# EAGLE design control_unit_new (EAGLE 5.11)

## Sheet 1 of 4
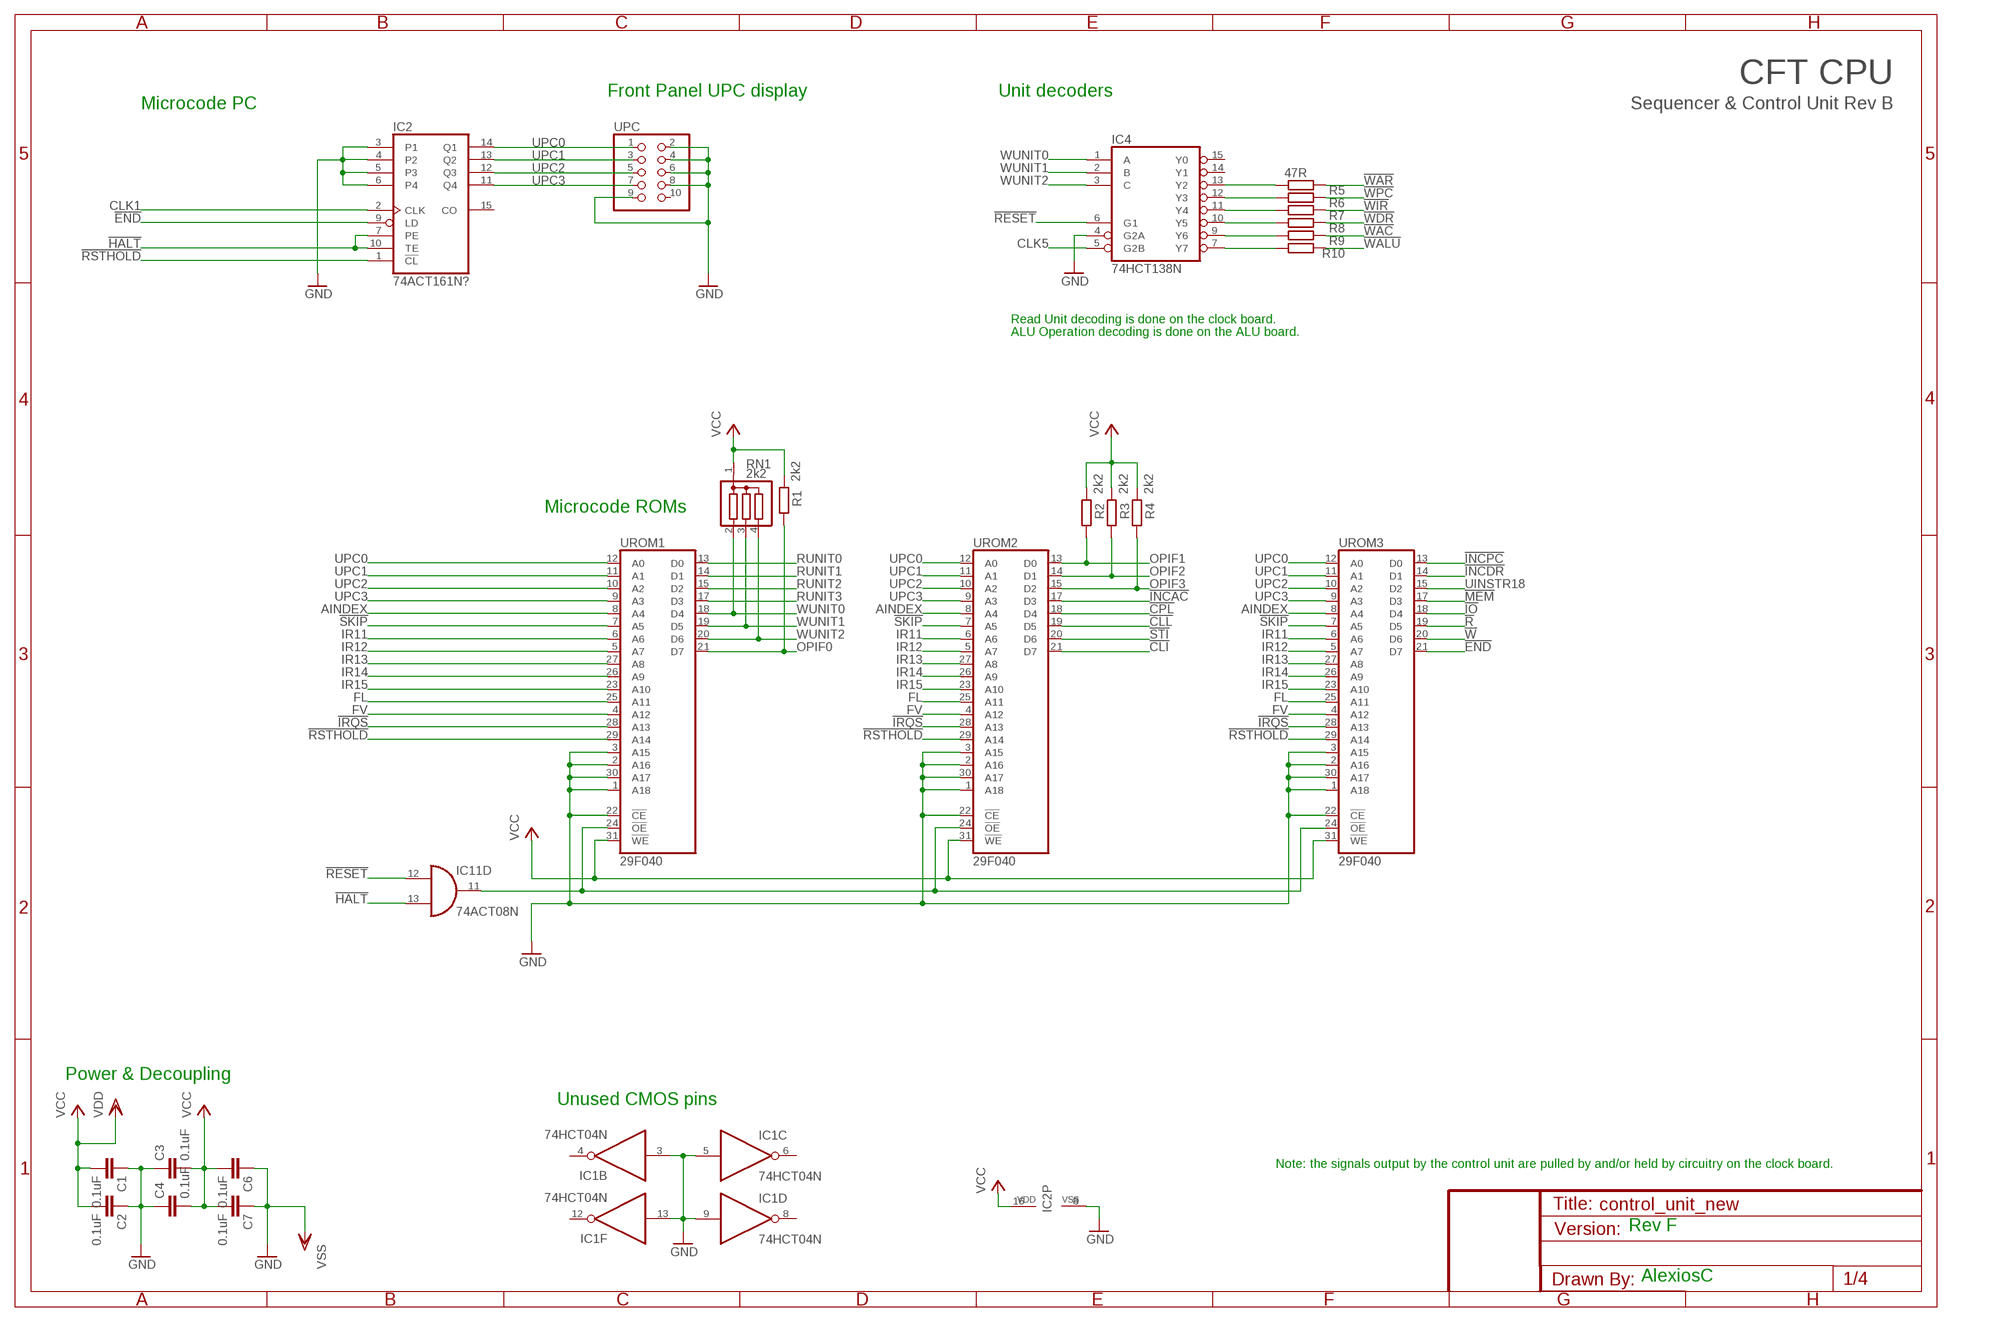
[diagram p0: schematic, sheet 1]

### Parts
C1  0.1uF  C-EU025-025X050  [C025-025X050]
C2  0.1uF  C-EU025-025X050  [C025-025X050]
C3  0.1uF  C-EU025-025X050  [C025-025X050]
C4  0.1uF  C-EU025-025X050  [C025-025X050]
C6  0.1uF  C-EU025-025X050  [C025-025X050]
C7  0.1uF  C-EU025-025X050  [C025-025X050]
IC1  74HCT04N  [DIL14]
IC2  74ACT161N?  4161P  [DIL16]
IC4  74HCT138N  [DIL16]
IC11  74ACT08N  [DIL14]
R1  2k2  R-EU_0207/7  [0207/7]
R2  2k2  R-EU_0207/7  [0207/7]
R3  2k2  R-EU_0207/7  [0207/7]
R4  2k2  R-EU_0207/7  [0207/7]
R5  47R  R-EU_0207/2V  [0207/2V]
R6  47R  R-EU_0207/2V  [0207/2V]
R7  47R  R-EU_0207/2V  [0207/2V]
R8  47R  R-EU_0207/2V  [0207/2V]
R9  47R  R-EU_0207/2V  [0207/2V]
R10  47R  R-EU_0207/2V  [0207/2V]
RN1  2k2  G03R  [SIL4]
UPC  PINHD-2X5/90  [2X05/90]
UROM1  29F040  29F040DIP32  [DIL32]
UROM2  29F040  29F040DIP32  [DIL32]
UROM3  29F040  29F040DIP32  [DIL32]

### Nets
!CLI: UROM2.21(D7)
!CLL: UROM2.19(D5)
!CPL: UROM2.18(D4)
!END: IC2.9(LD) UROM3.21(D7)
!HALT: IC2.7(PE) IC2.10(TE) IC11.13(D:I1) ; also sheet 3
!INCAC: UROM2.17(D3)
!INCDR: UROM3.14(D1)
!INCPC: UROM3.13(D0) ; also sheet 3
!IO: UROM3.18(D4) ; also sheet 3
!IRQS: UROM1.28(A13) UROM2.28(A13) UROM3.28(A13)
!MEM: UROM3.17(D3) ; also sheet 3
!R: UROM3.19(D5) ; also sheet 3
!RESET: IC4.6(G1) IC11.12(D:I0) ; also sheet 2,3
!RSTHOLD: IC2.1(!CL) UROM1.29(A14) UROM2.29(A14) UROM3.29(A14) ; also sheet 2,3
!SKIP: UROM1.7(A5) UROM2.7(A5) UROM3.7(A5) ; also sheet 2
!STI: UROM2.20(D6)
!W: UROM3.20(D6) ; also sheet 3
!WAC: R9.2 ; also sheet 3
!WALU: R10.2 ; also sheet 3
!WAR: R5.2 ; also sheet 3
!WDR: R8.2 ; also sheet 3
!WIR: R7.2 ; also sheet 2,3
!WPC: R6.2 ; also sheet 3
AINDEX: UROM1.8(A4) UROM2.8(A4) UROM3.8(A4)
CLK1: IC2.2(CLK) ; also sheet 2,3
CLK5: IC4.5(G2B) ; also sheet 3
FL: UROM1.25(A11) UROM2.25(A11) UROM3.25(A11) ; also sheet 2
FV: UROM1.4(A12) UROM2.4(A12) UROM3.4(A12) ; also sheet 2
GND [Power]: C1.1 C2.1 C3.1 C4.1 C6.1 C7.1 IC1.3(B:I) IC1.5(C:I) IC1.9(D:I) IC1.13(F:I) IC2.3(P1) IC2.4(P2) IC2.5(P3) IC2.6(P4) IC2.8(VSS) IC4.4(G2A) UPC.2 UPC.4 UPC.6 UPC.8 UPC.9 UROM1.1(A18) UROM1.2(A16) UROM1.3(A15) UROM1.22(!CE) UROM1.30(A17) UROM2.1(A18) UROM2.2(A16) UROM2.3(A15) UROM2.22(!CE) UROM2.30(A17) UROM3.1(A18) UROM3.2(A16) UROM3.3(A15) UROM3.22(!CE) UROM3.30(A17) ; supply symbol labelled VSS ; also sheet 2,3,4
IR11: UROM1.6(A6) UROM2.6(A6) UROM3.6(A6) ; also sheet 2
IR12: UROM1.5(A7) UROM2.5(A7) UROM3.5(A7) ; also sheet 2
IR13: UROM1.27(A8) UROM2.27(A8) UROM3.27(A8) ; also sheet 2
IR14: UROM1.26(A9) UROM2.26(A9) UROM3.26(A9) ; also sheet 2
IR15: UROM1.23(A10) UROM2.23(A10) UROM3.23(A10) ; also sheet 2
N$1: IC11.11(D:O) UROM1.24(!OE) UROM2.24(!OE) UROM3.24(!OE)
N$7: IC4.13(Y2) R5.1
N$8: IC4.12(Y3) R6.1
N$9: IC4.11(Y4) R7.1
N$10: IC4.10(Y5) R8.1
N$11: IC4.9(Y6) R9.1
N$12: IC4.7(Y7) R10.1
OPIF0: R1.1 UROM1.21(D7) ; also sheet 2
OPIF1: R2.1 UROM2.13(D0) ; also sheet 2
OPIF2: R3.1 UROM2.14(D1) ; also sheet 2
OPIF3: R4.1 UROM2.15(D2) ; also sheet 2
RUNIT0: UROM1.13(D0)
RUNIT1: UROM1.14(D1)
RUNIT2: UROM1.15(D2)
RUNIT3: UROM1.17(D3)
UINSTR18: UROM3.15(D2)
UPC0: IC2.14(Q1) UPC.1 UROM1.12(A0) UROM2.12(A0) UROM3.12(A0)
UPC1: IC2.13(Q2) UPC.3 UROM1.11(A1) UROM2.11(A1) UROM3.11(A1)
UPC2: IC2.12(Q3) UPC.5 UROM1.10(A2) UROM2.10(A2) UROM3.10(A2)
UPC3: IC2.11(Q4) UPC.7 UROM1.9(A3) UROM2.9(A3) UROM3.9(A3)
VCC [Power]: C1.2 C2.2 C3.2 C4.2 C6.2 C7.2 IC2.16(VDD) R1.2 R2.2 R3.2 R4.2 RN1.1 UROM1.31(!WE) UROM2.31(!WE) UROM3.31(!WE) ; supply symbol labelled VDD ; also sheet 2,3,4
WUNIT0: IC4.1(A) RN1.2 UROM1.18(D4)
WUNIT1: IC4.2(B) RN1.3 UROM1.19(D5)
WUNIT2: IC4.3(C) RN1.4 UROM1.20(D6)
Unconnected: IC1.1(A:I) IC1.2(A:O) IC1.4(B:O) IC1.6(C:O) IC1.8(D:O) IC1.12(F:O) IC2.15(CO) IC4.14(Y1) IC4.15(Y0) UPC.10

### Notes on the sheet
- CFT CPU
- Front Panel UPC display | Unit decoders
- Microcode PC | Sequencer & Control Unit Rev B
- Read Unit decoding is done on the clock board.
- ALU Operation decoding is done on the ALU board.
- Microcode ROMs
- Power & Decoupling
- Unused CMOS pins
- Note: the signals output by the control unit are pulled by and/or held by circuitry on the clock board.
- Rev F
- AlexiosC

## Sheet 2 of 4
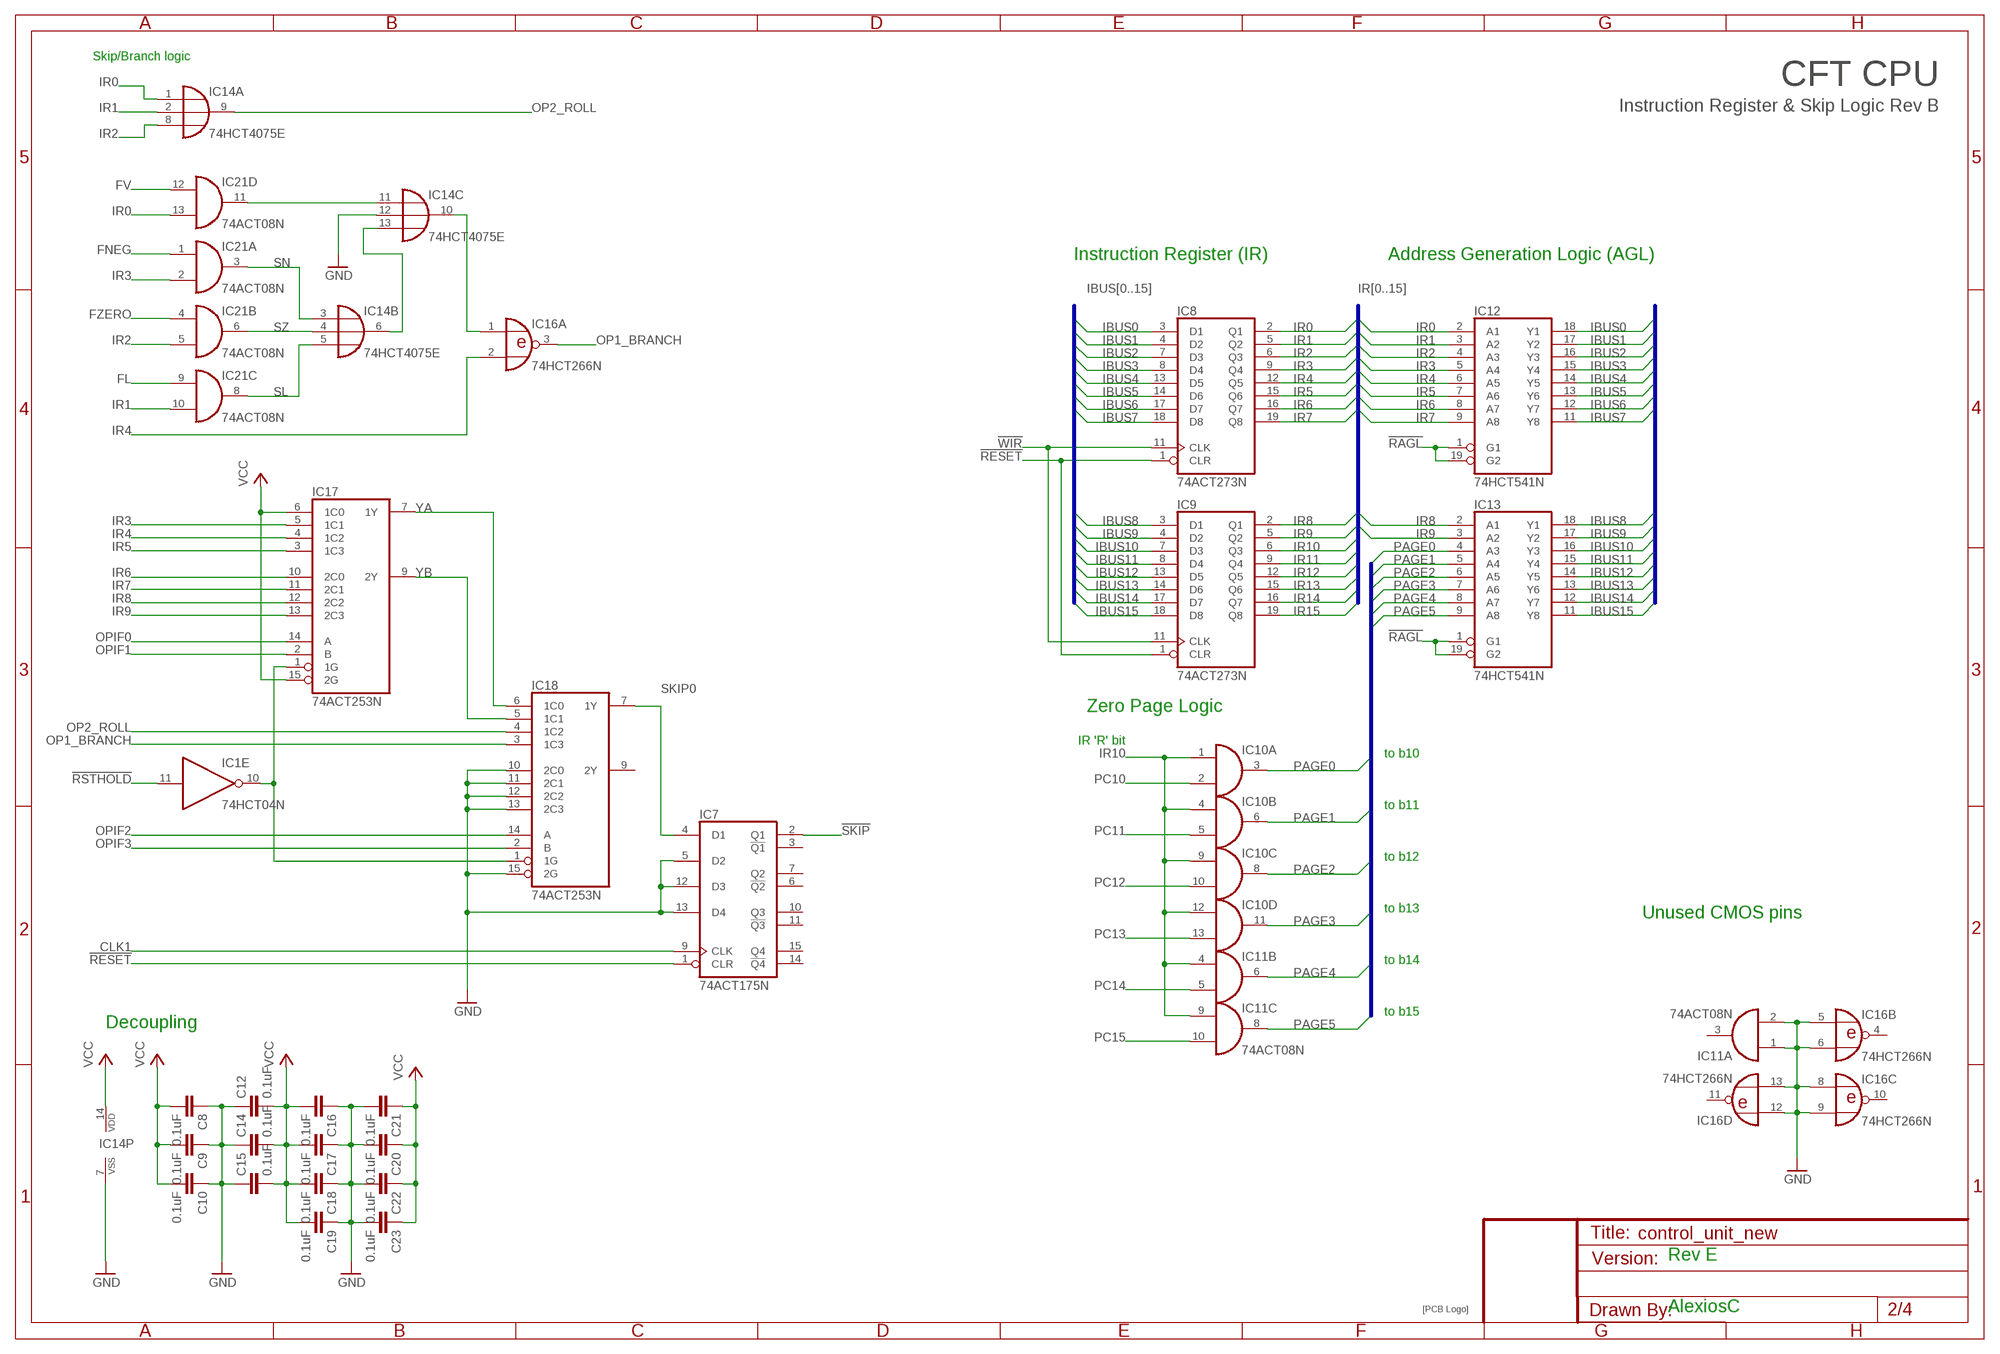
[diagram p1: schematic, sheet 2]

### Parts
C8  0.1uF  C-EU025-025X050  [C025-025X050]
C9  0.1uF  C-EU025-025X050  [C025-025X050]
C10  0.1uF  C-EU025-025X050  [C025-025X050]
C12  0.1uF  C-EU025-025X050  [C025-025X050]
C14  0.1uF  C-EU025-025X050  [C025-025X050]
C15  0.1uF  C-EU025-025X050  [C025-025X050]
C16  0.1uF  C-EU025-025X050  [C025-025X050]
C17  0.1uF  C-EU025-025X050  [C025-025X050]
C18  0.1uF  C-EU025-025X050  [C025-025X050]
C19  0.1uF  C-EU025-025X050  [C025-025X050]
C20  0.1uF  C-EU025-025X050  [C025-025X050]
C21  0.1uF  C-EU025-025X050  [C025-025X050]
C22  0.1uF  C-EU025-025X050  [C025-025X050]
C23  0.1uF  C-EU025-025X050  [C025-025X050]
IC7  74ACT175N  [DIL16]
IC8  74ACT273N  [DIL20]
IC9  74ACT273N  [DIL20]
IC10  74ACT08N  [DIL14]
IC12  74HCT541N  [DIL20]
IC13  74HCT541N  [DIL20]
IC14  74HCT4075E  4075N  [DIL14]
IC16  74HCT266N  74HC266N  [DIL14]
IC17  74ACT253N  [DIL16]
IC18  74ACT253N  [DIL16]
IC21  74ACT08N  [DIL14]
U$3  SIGNATURESILK  [SIGNATURE]

### Nets
!RAGL: IC12.1(G1) IC12.19(G2) IC13.1(G1) IC13.19(G2) ; also sheet 3
!RESET: IC7.1(CLR) IC8.1(CLR) IC9.1(CLR) ; also sheet 1,3
!RSTHOLD: IC1.11(E:I) ; also sheet 1,3
!SKIP: IC7.2(Q1) ; also sheet 1
!WIR: IC8.11(CLK) IC9.11(CLK) ; also sheet 1,3
CLK1: IC7.9(CLK) ; also sheet 1,3
FL: IC21.9(C:I0) ; also sheet 1
FNEG: IC21.1(A:I0)
FV: IC21.12(D:I0) ; also sheet 1
FZERO: IC21.4(B:I0)
GND [Power]: C8.1 C9.1 C10.1 C12.1 C14.1 C15.1 C16.1 C17.1 C18.1 C19.1 C20.2 C21.2 C22.2 C23.2 IC7.5(D2) IC7.12(D3) IC7.13(D4) IC11.1(A:I0) IC11.2(A:I1) IC14.7(P:VSS) IC14.12(C:I1) IC16.5(B:I0) IC16.6(B:I1) IC16.8(C:I0) IC16.9(C:I1) IC16.12(D:I0) IC16.13(D:I1) IC18.10(2C0) IC18.11(2C1) IC18.12(2C2) IC18.13(2C3) IC18.15(2G) ; also sheet 1,3,4
IBUS0: IC8.3(D1) IC12.18(Y1) ; also sheet 3
IBUS1: IC8.4(D2) IC12.17(Y2) ; also sheet 3
IBUS2: IC8.7(D3) IC12.16(Y3) ; also sheet 3
IBUS3: IC8.8(D4) IC12.15(Y4) ; also sheet 3
IBUS4: IC8.13(D5) IC12.14(Y5) ; also sheet 3
IBUS5: IC8.14(D6) IC12.13(Y6) ; also sheet 3
IBUS6: IC8.17(D7) IC12.12(Y7) ; also sheet 3
IBUS7: IC8.18(D8) IC12.11(Y8) ; also sheet 3
IBUS8: IC9.3(D1) IC13.18(Y1) ; also sheet 3
IBUS9: IC9.4(D2) IC13.17(Y2) ; also sheet 3
IBUS10: IC9.7(D3) IC13.16(Y3) ; also sheet 3
IBUS11: IC9.8(D4) IC13.15(Y4) ; also sheet 3
IBUS12: IC9.13(D5) IC13.14(Y5) ; also sheet 3
IBUS13: IC9.14(D6) IC13.13(Y6) ; also sheet 3
IBUS14: IC9.17(D7) IC13.12(Y7) ; also sheet 3
IBUS15: IC9.18(D8) IC13.11(Y8) ; also sheet 3
IR0: IC8.2(Q1) IC12.2(A1) IC14.1(A:I0) IC21.13(D:I1)
IR1: IC8.5(Q2) IC12.3(A2) IC14.2(A:I1) IC21.10(C:I1)
IR2: IC8.6(Q3) IC12.4(A3) IC14.8(A:I2) IC21.5(B:I1)
IR3: IC8.9(Q4) IC12.5(A4) IC17.5(1C1) IC21.2(A:I1)
IR4: IC8.12(Q5) IC12.6(A5) IC16.2(A:I1) IC17.4(1C2)
IR5: IC8.15(Q6) IC12.7(A6) IC17.3(1C3)
IR6: IC8.16(Q7) IC12.8(A7) IC17.10(2C0)
IR7: IC8.19(Q8) IC12.9(A8) IC17.11(2C1)
IR8: IC9.2(Q1) IC13.2(A1) IC17.12(2C2)
IR9: IC9.5(Q2) IC13.3(A2) IC17.13(2C3)
IR10: IC9.6(Q3) IC10.1(A:I0) IC10.4(B:I0) IC10.9(C:I0) IC10.12(D:I0) IC11.4(B:I0) IC11.9(C:I0)
IR11: IC9.9(Q4) ; also sheet 1
IR12: IC9.12(Q5) ; also sheet 1
IR13: IC9.15(Q6) ; also sheet 1
IR14: IC9.16(Q7) ; also sheet 1
IR15: IC9.19(Q8) ; also sheet 1
N$2: IC14.10(C:O) IC16.1(A:I0)
N$13: IC14.6(B:O) IC14.13(C:I2)
N$14: IC14.11(C:I0) IC21.11(D:O)
OP1_BRANCH: IC16.3(A:O) IC18.3(1C3)
OP2_ROLL: IC14.9(A:O) IC18.4(1C2)
OPIF0: IC17.14(A) ; also sheet 1
OPIF1: IC17.2(B) ; also sheet 1
OPIF2: IC18.14(A) ; also sheet 1
OPIF3: IC18.2(B) ; also sheet 1
PAGE0: IC10.3(A:O) IC13.4(A3)
PAGE1: IC10.6(B:O) IC13.5(A4)
PAGE2: IC10.8(C:O) IC13.6(A5)
PAGE3: IC10.11(D:O) IC13.7(A6)
PAGE4: IC11.6(B:O) IC13.8(A7)
PAGE5: IC11.8(C:O) IC13.9(A8)
PC10: IC10.2(A:I1)
PC11: IC10.5(B:I1)
PC12: IC10.10(C:I1)
PC13: IC10.13(D:I1)
PC14: IC11.5(B:I1)
PC15: IC11.10(C:I1)
RSTHOLD: IC1.10(E:O) IC17.1(1G) IC18.1(1G)
SKIP0: IC7.4(D1) IC18.7(1Y)
SL: IC14.5(B:I2) IC21.8(C:O)
SN: IC14.3(B:I0) IC21.3(A:O)
SZ: IC14.4(B:I1) IC21.6(B:O)
VCC [Power]: C8.2 C9.2 C10.2 C12.2 C14.2 C15.2 C16.2 C17.2 C18.2 C19.2 C20.1 C21.1 C22.1 C23.1 IC14.14(P:VDD) IC17.6(1C0) IC17.15(2G) ; also sheet 1,3,4
YA: IC17.7(1Y) IC18.6(1C0)
YB: IC17.9(2Y) IC18.5(1C1)
Unconnected: IC7.3(!Q1) IC7.6(!Q2) IC7.7(Q2) IC7.10(Q3) IC7.11(!Q3) IC7.14(!Q4) IC7.15(Q4) IC11.3(A:O) IC16.4(B:O) IC16.10(C:O) IC16.11(D:O) IC18.9(2Y)

### Buses
IBUS[0..15]
IR[0..15]
PAGE[0..5]

### Notes on the sheet
- Skip/Branch logic
- CFT CPU
- Instruction Register & Skip Logic Rev B
- Instruction Register (IR) | Address Generation Logic (AGL)
- Zero Page Logic
- IR 'R' bit
- to b10
- to b11
- to b12
- to b13
- Unused CMOS pins
- to b14
- to b15
- Decoupling
- Rev E
- AlexiosC

## Sheet 3 of 4
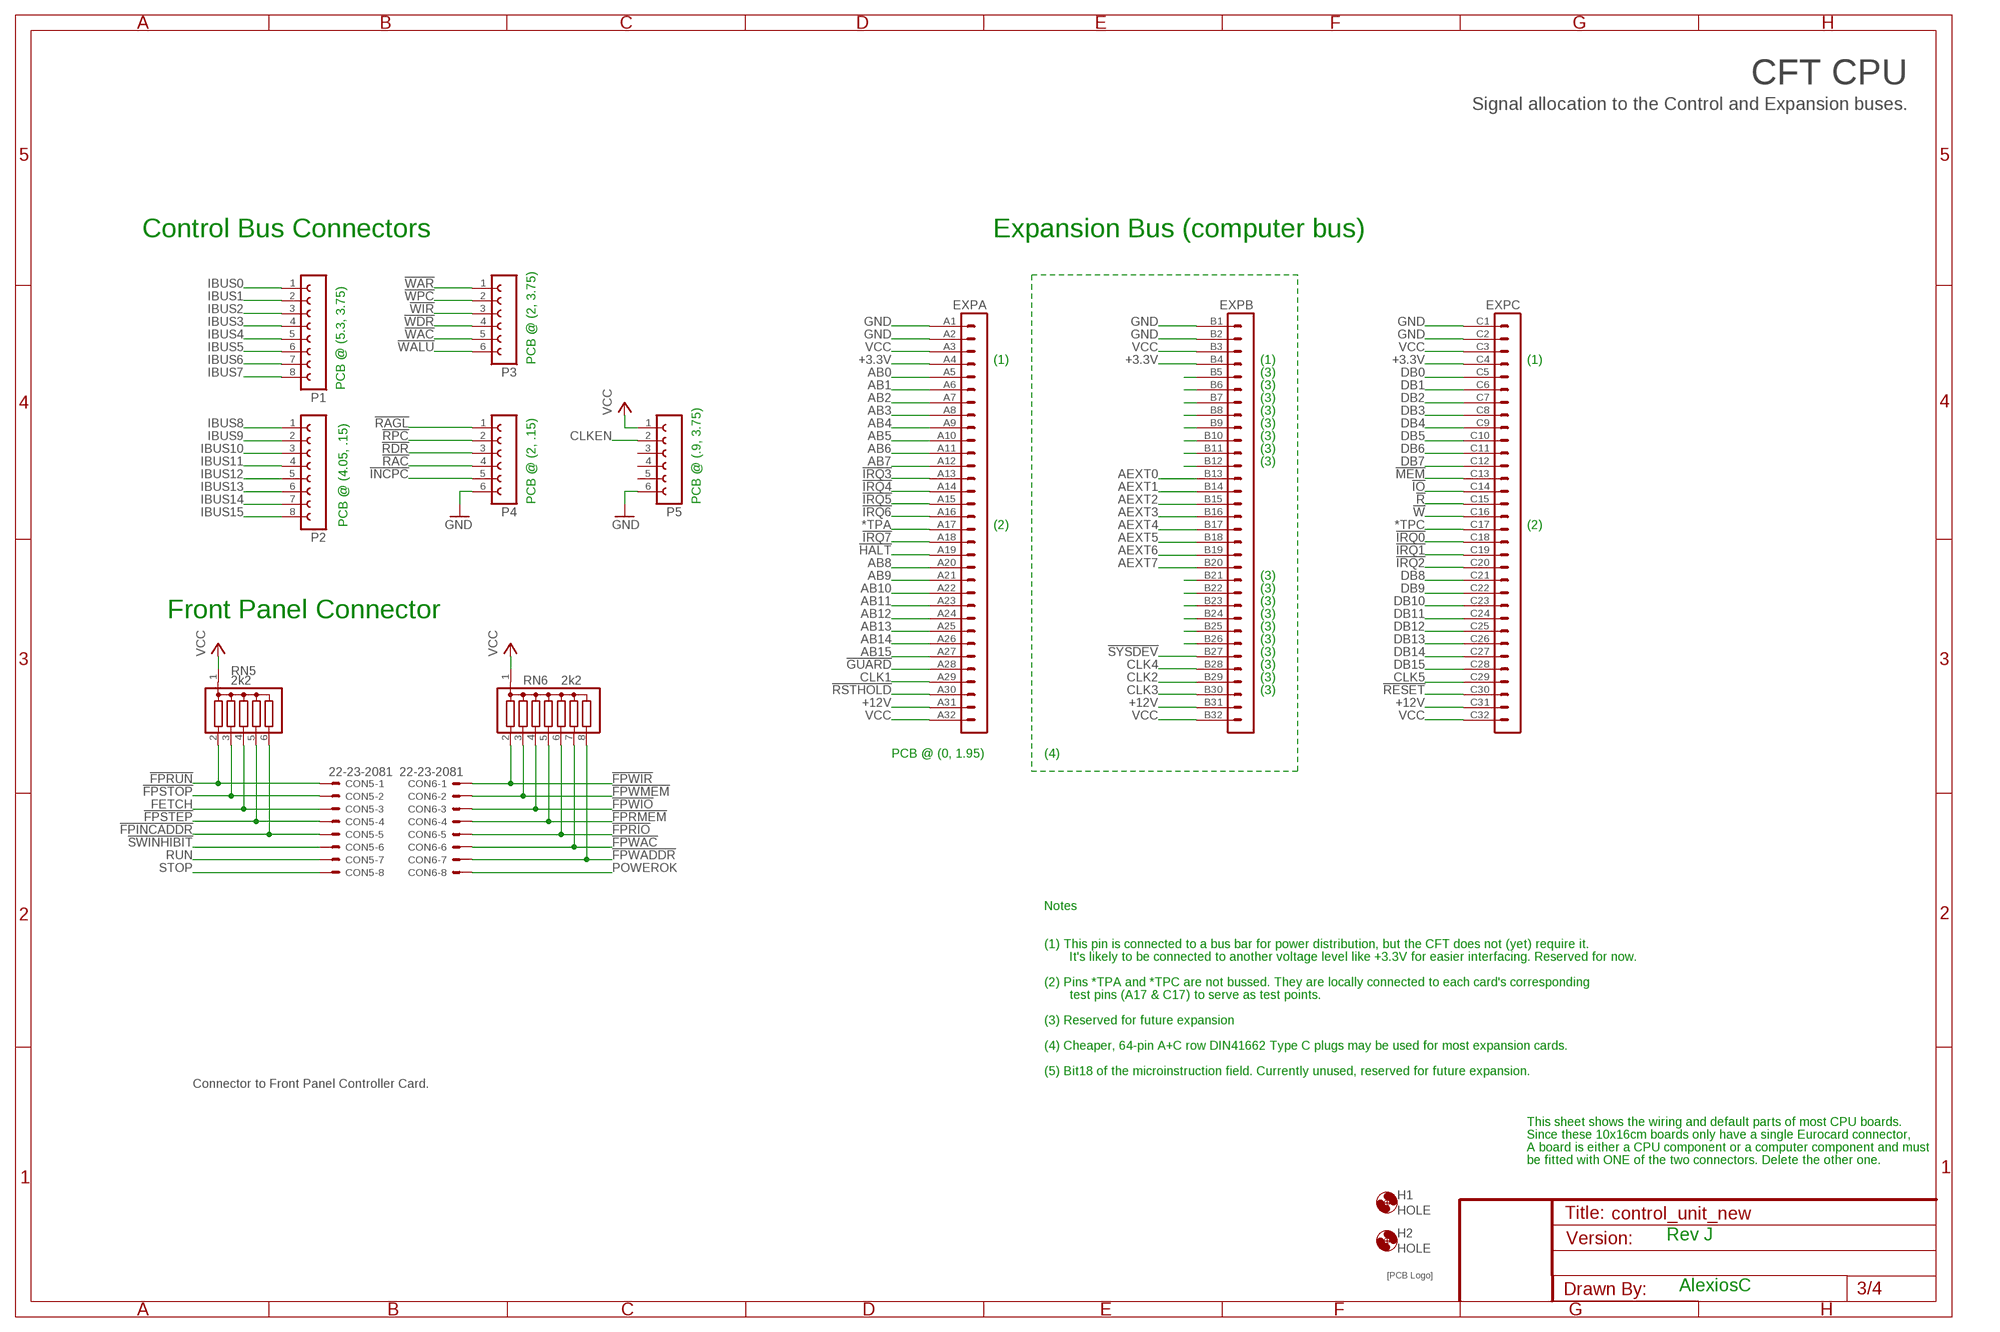
[diagram p2: schematic, sheet 3]

### Parts
CON5  22-23-2081  [22-23-2081]
CON6  22-23-2081  [22-23-2081]
EXP  VG96-3B  [VG96B]
H1  HOLE  [STANDOFF_28_60]
H2  HOLE  [STANDOFF_28_60]
P1  FE08-1  [FE08]
P2  FE08-1  [FE08]
P3  FE06-1  [FE06]
P4  FE06-1  [FE06]
P5  FE06-1  [FE06]
RN5  2k2  G05R  [SIL6]
RN6  2k2  G07R  [SIL8]
U$1  SIGNATURESILK  [SIGNATURE]

### Nets
!FPINCADDR: CON5.5 RN5.6
!FPRIO: CON6.5 RN6.6
!FPRMEM: CON6.4 RN6.5
!FPRUN: CON5.1 RN5.2
!FPSTEP: CON5.4 RN5.5
!FPSTOP: CON5.2 RN5.3
!FPWAC: CON6.6 RN6.7
!FPWADDR: CON6.7 RN6.8
!FPWIO: CON6.3 RN6.4
!FPWIR: CON6.1 RN6.2
!FPWMEM: CON6.2 RN6.3
!GUARD: EXP.A28
!HALT: EXP.A19 ; also sheet 1
!INCPC: P4.5 ; also sheet 1
!IO: EXP.C14 ; also sheet 1
!IRQ0: EXP.C18
!IRQ1: EXP.C19
!IRQ2: EXP.C20
!IRQ3: EXP.A13
!IRQ4: EXP.A14
!IRQ5: EXP.A15
!IRQ6: EXP.A16
!IRQ7: EXP.A18
!MEM: EXP.C13 ; also sheet 1
!R: EXP.C15 ; also sheet 1
!RAC: P4.4
!RAGL: P4.1 ; also sheet 2
!RDR: P4.3
!RESET: EXP.C30 ; also sheet 1,2
!RPC: P4.2
!RSTHOLD: EXP.A30 ; also sheet 1,2
!SWINHIBIT: CON5.6
!SYSDEV: EXP.B27
!W: EXP.C16 ; also sheet 1
!WAC: P3.5 ; also sheet 1
!WALU: P3.6 ; also sheet 1
!WAR: P3.1 ; also sheet 1
!WDR: P3.4 ; also sheet 1
!WIR: P3.3 ; also sheet 1,2
!WPC: P3.2 ; also sheet 1
*TPA: EXP.A17
*TPC: EXP.C17
+3.3V: EXP.A4 EXP.B4 EXP.C4
+12V [12V]: EXP.A31 EXP.B31 EXP.C31
AB0: EXP.A5
AB1: EXP.A6
AB2: EXP.A7
AB3: EXP.A8
AB4: EXP.A9
AB5: EXP.A10
AB6: EXP.A11
AB7: EXP.A12
AB8: EXP.A20
AB9: EXP.A21
AB10: EXP.A22
AB11: EXP.A23
AB12: EXP.A24
AB13: EXP.A25
AB14: EXP.A26
AB15: EXP.A27
AEXT0: EXP.B13
AEXT1: EXP.B14
AEXT2: EXP.B15
AEXT3: EXP.B16
AEXT4: EXP.B17
AEXT5: EXP.B18
AEXT6: EXP.B19
AEXT7: EXP.B20
CLK1: EXP.A29 ; also sheet 1,2
CLK2: EXP.B29
CLK3: EXP.B30
CLK4: EXP.B28
CLK5: EXP.C29 ; also sheet 1
CLKEN: P5.2
DB0: EXP.C5
DB1: EXP.C6
DB2: EXP.C7
DB3: EXP.C8
DB4: EXP.C9
DB5: EXP.C10
DB6: EXP.C11
DB7: EXP.C12
DB8: EXP.C21
DB9: EXP.C22
DB10: EXP.C23
DB11: EXP.C24
DB12: EXP.C25
DB13: EXP.C26
DB14: EXP.C27
DB15: EXP.C28
FETCH: CON5.3 RN5.4
GND [Power]: EXP.A1 EXP.A2 EXP.B1 EXP.B2 EXP.C1 EXP.C2 P4.6 P5.6 ; also sheet 1,2,4
IBUS0: P1.1 ; also sheet 2
IBUS1: P1.2 ; also sheet 2
IBUS2: P1.3 ; also sheet 2
IBUS3: P1.4 ; also sheet 2
IBUS4: P1.5 ; also sheet 2
IBUS5: P1.6 ; also sheet 2
IBUS6: P1.7 ; also sheet 2
IBUS7: P1.8 ; also sheet 2
IBUS8: P2.1 ; also sheet 2
IBUS9: P2.2 ; also sheet 2
IBUS10: P2.3 ; also sheet 2
IBUS11: P2.4 ; also sheet 2
IBUS12: P2.5 ; also sheet 2
IBUS13: P2.6 ; also sheet 2
IBUS14: P2.7 ; also sheet 2
IBUS15: P2.8 ; also sheet 2
N$23: EXP.B12
N$24: EXP.B11
N$25: EXP.B10
N$26: EXP.B9
N$27: EXP.B8
N$28: EXP.B7
N$29: EXP.B6
N$30: EXP.B5
N$33: EXP.B26
N$34: EXP.B25
N$35: EXP.B24
N$36: EXP.B23
N$37: EXP.B22
N$38: EXP.B21
POWEROK: CON6.8
RUN: CON5.7
STOP: CON5.8
VCC [Power]: EXP.A3 EXP.A32 EXP.B3 EXP.B32 EXP.C3 EXP.C32 P5.1 RN5.1 RN6.1 ; also sheet 1,2,4
Unconnected: P5.3 P5.4 P5.5

### Notes on the sheet
- CFT CPU
- Signal allocation to the Control and Expansion buses.
- Control Bus Connectors | Expansion Bus (computer bus)
- PCB @ (2, 3.75) | (1) | (1) | (1)
- (3)
- PCB @ (5.3, 3.75) | (3)
- (3)
- (3)
- (3)
- (3)
- (3)
- (3)
- PCB @ (2, .15) | PCB @ (.9, 3.75)
- PCB @ (4.05, .15) | (2) | (2)
- (3)
- (3)
- (3)
- Front Panel Connector | (3)
- (3)
- (3)
- (3)
- (3)
- (3)
- (3)
- PCB @ (0, 1.95) | (4)
- Notes
- (1) This pin is connected to a bus bar for power distribution, but the CFT does not (yet) require it.
- It's likely to be connected to another voltage level like +3.3V for easier interfacing. Reserved for now.
- (2) Pins *TPA and *TPC are not bussed. They are locally connected to each card's corresponding
- test pins (A17 & C17) to serve as test points.
- (3) Reserved for future expansion
- (4) Cheaper, 64-pin A+C row DIN41662 Type C plugs may be used for most expansion cards.
- (5) Bit18 of the microinstruction field. Currently unused, reserved for future expansion.
- Connector to Front Panel Controller Card.
- This sheet shows the wiring and default parts of most CPU boards.
- Since these 10x16cm boards only have a single Eurocard connector,
- A board is either a CPU component or a computer component and must
- be fitted with ONE of the two connectors. Delete the other one.
- Rev J
- AlexiosC

## Sheet 4 of 4
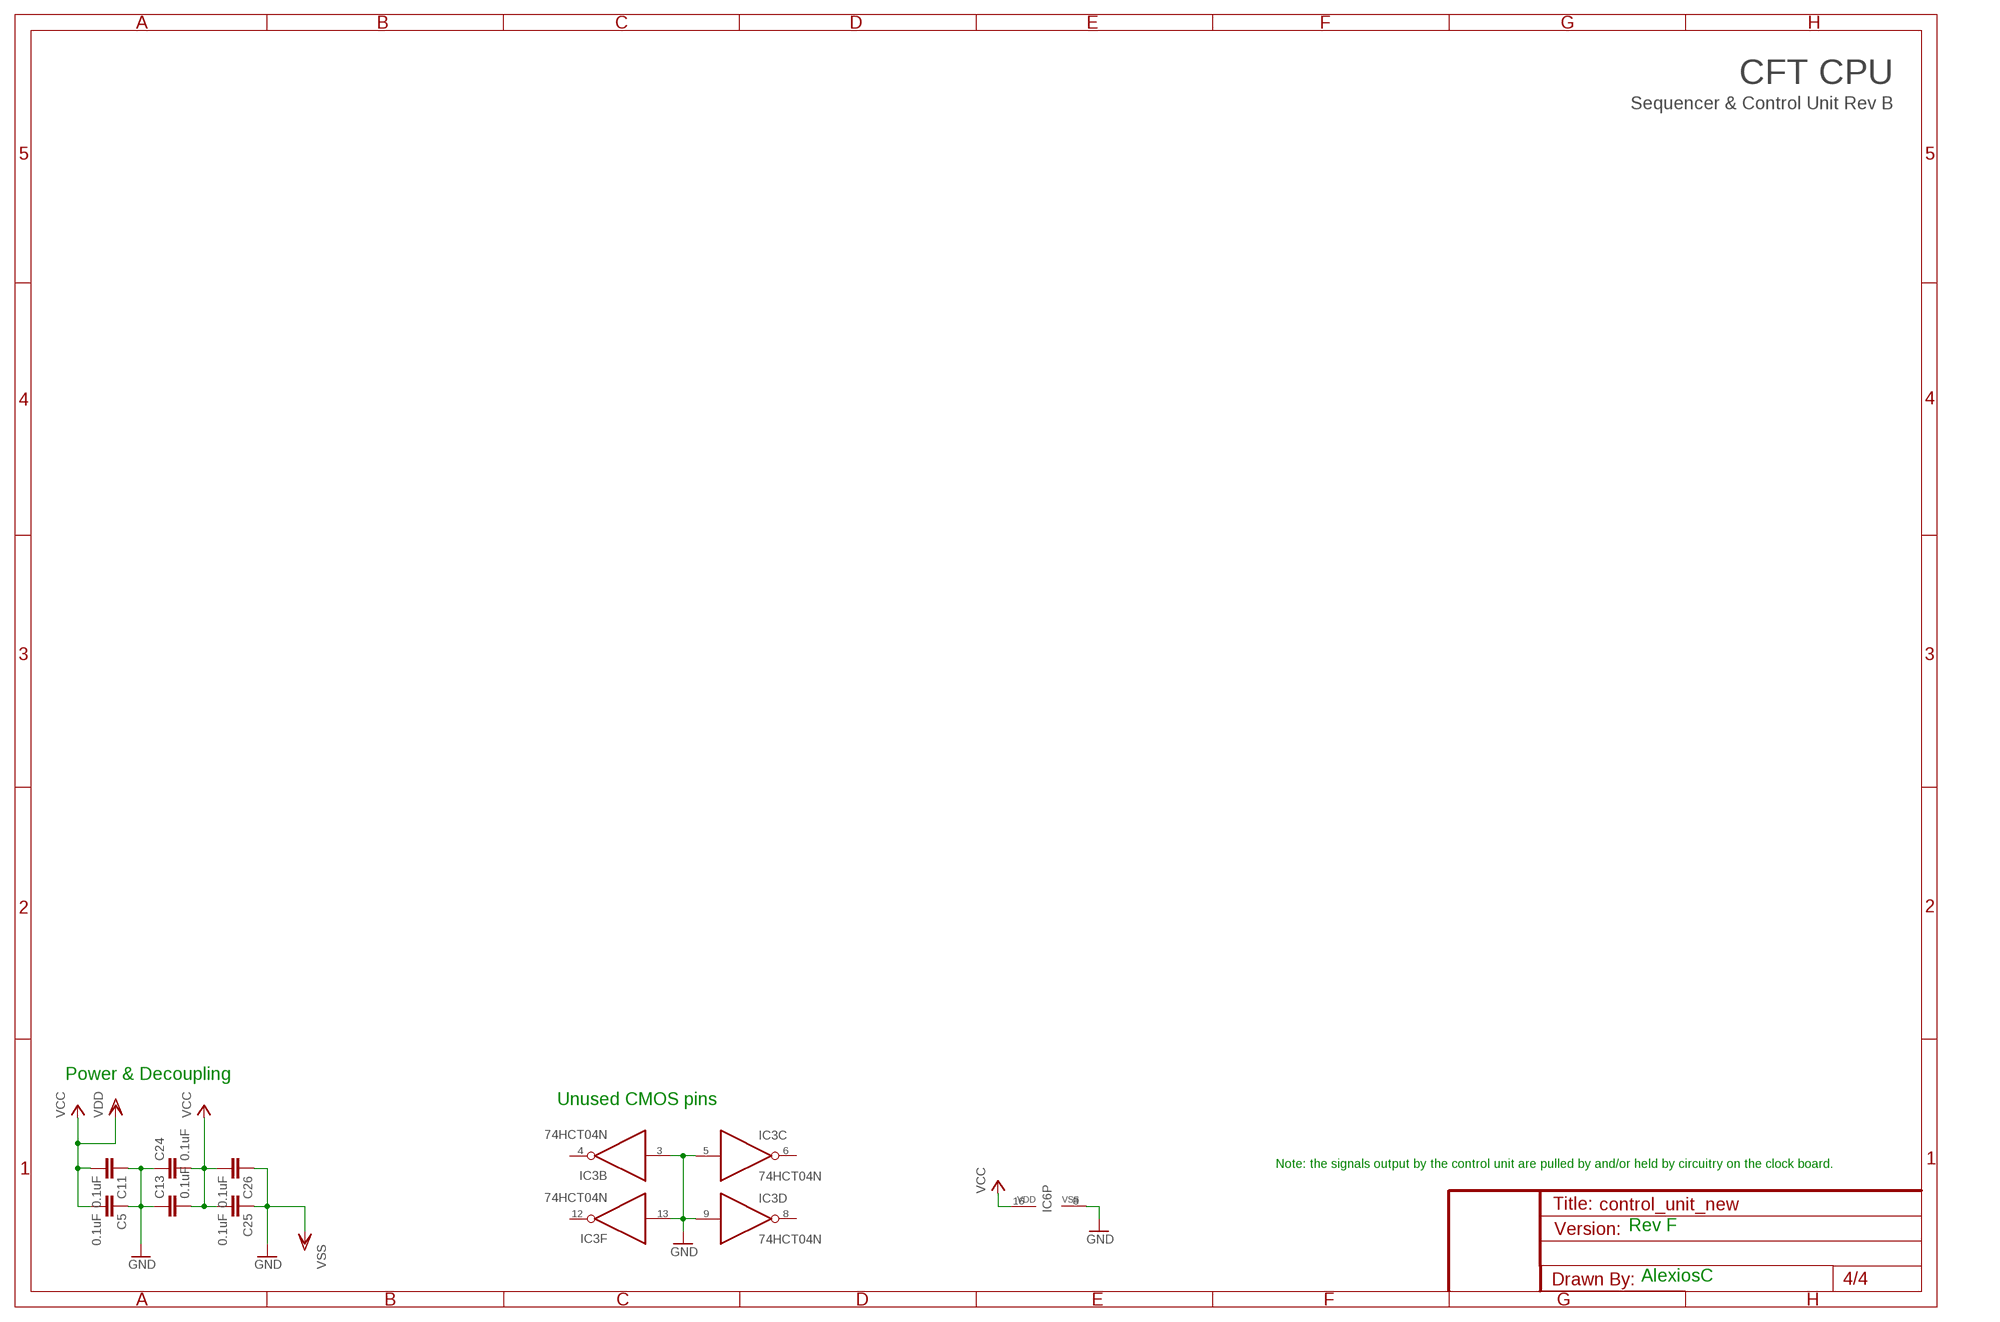
[diagram p3: schematic, sheet 4]

### Parts
C5  0.1uF  C-EU025-025X050  [C025-025X050]
C11  0.1uF  C-EU025-025X050  [C025-025X050]
C13  0.1uF  C-EU025-025X050  [C025-025X050]
C24  0.1uF  C-EU025-025X050  [C025-025X050]
C25  0.1uF  C-EU025-025X050  [C025-025X050]
C26  0.1uF  C-EU025-025X050  [C025-025X050]
IC3  74HCT04N  [DIL14]
IC6  74ACT161N?  4161P  [DIL16]

### Nets
GND [Power]: C5.1 C11.1 C13.1 C24.1 C25.1 C26.1 IC3.3(B:I) IC3.5(C:I) IC3.9(D:I) IC3.13(F:I) IC6.8(VSS) ; supply symbol labelled VSS ; also sheet 1,2,3
VCC [Power]: C5.2 C11.2 C13.2 C24.2 C25.2 C26.2 IC6.16(VDD) ; supply symbol labelled VDD ; also sheet 1,2,3
Unconnected: IC3.1(A:I) IC3.2(A:O) IC3.4(B:O) IC3.6(C:O) IC3.8(D:O) IC3.10(E:O) IC3.11(E:I) IC3.12(F:O) IC6.1(!CL) IC6.2(CLK) IC6.3(P1) IC6.4(P2) IC6.5(P3) IC6.6(P4) IC6.7(PE) IC6.9(LD) IC6.10(TE) IC6.11(Q4) IC6.12(Q3) IC6.13(Q2) IC6.14(Q1) IC6.15(CO)

### Notes on the sheet
- CFT CPU
- Sequencer & Control Unit Rev B
- Power & Decoupling
- Unused CMOS pins
- Note: the signals output by the control unit are pulled by and/or held by circuitry on the clock board.
- Rev F
- AlexiosC

## Power pins joined to a net without a drawn wire
GND: IC1.7(P:GND) IC3.7(P:GND) IC4.8(GND) IC7.8(GND) IC8.10(GND) IC9.10(GND) IC10.7(P:GND) IC11.7(P:GND) IC12.10(GND) IC13.10(GND) IC16.7(P:GND) IC17.8(GND) IC18.8(GND) IC21.7(P:GND) UROM1.16(GND) UROM2.16(GND) UROM3.16(GND)
VCC: IC1.14(P:VCC) IC3.14(P:VCC) IC4.16(VCC) IC7.16(VCC) IC8.20(VCC) IC9.20(VCC) IC10.14(P:VCC) IC11.14(P:VCC) IC12.20(VCC) IC13.20(VCC) IC16.14(P:VCC) IC17.16(VCC) IC18.16(VCC) IC21.14(P:VCC) UROM1.32(VCC) UROM2.32(VCC) UROM3.32(VCC)

## Library data of the parts
C1-C26 = rcl:C-EU: CAPACITOR, European symbol
CON5 CON6 = con-molex:22-23-2081: .100" (2.54mm) Center Header - 8 Pin; MF: MOLEX; MPN: 22-23-2081; OC_FARNELL: 1756826; OC_NEWARK: 01C7592
EXP = 19inch:VG96-3: PCB EUROCARD, 96-pin type C/ABC, 2.54 mm
H1 H2 = alexios:HOLE: Hole for a standoff or mount. Hole diameter: 3.3mm. External Diameter: 6mm.
IC1 IC3 = 74xx-eu:74*04: Hex INVERTER
IC2 IC6 = 41xx:4161: 41xx DEVICE
IC4 = 74xx-eu:74*138: 3-line to 8-line DECODER/DEMULTIPLEXER
IC7 = 74xx-eu:74*175: Qadruple D type FLIP FLOP, clear
IC8 IC9 = 74xx-eu:74*273: Octal D type FLIP FLOP, clear
IC10 IC11 IC21 = 74xx-eu:74*08: Quad 2-input AND gate
IC12 IC13 = 74xx-eu:74*541: Octal BUFFER and LINE DRIVER, 3-state
IC14 = 40xx:4075: Triple 3-input OR
IC16 = 74xx-eu:74*266: Quadruple EXCLUSIVE-NOR (XNOR), open-collector
IC17 IC18 = 74xx-eu:74*253: Dual 4-to 1 line data SELECTOR/MULTIPLEXER, 3-state
P1 P2 = con-lsta:FE08-1: FEMALE HEADER; OC_FARNELL: unknown; OC_NEWARK: unknown
P3-P5 = con-lsta:FE06-1: FEMALE HEADER; OC_FARNELL: unknown; OC_NEWARK: unknown
R1-R10 = resistor:R-EU_: RESISTOR, European symbol
RN1 = resistor-sil:G03R: SIL RESISTOR; OC_FARNELL: unknown; OC_NEWARK: unknown
RN5 = resistor-sil:G05R: SIL RESISTOR; OC_FARNELL: unknown; OC_NEWARK: unknown
RN6 = resistor-sil:G07R: SIL RESISTOR; OC_FARNELL: unknown; OC_NEWARK: unknown
U$1 U$3 = alexios:SIGNATURE: Soup signature
UPC = pinhead:PINHD-2X5: PIN HEADER
UROM1-UROM3 = alexios:29F040: 4-mbit (512x8) Flash memory in a PLCC32 package (with socket). AM29F040 is an example of this.

## Net classes
0 default: width 0.305 mm, clearance 0.254 mm
1 Power: width 0.635 mm, clearance 0.254 mm
2 12V: width 0.635 mm, clearance 0.635 mm

## Board
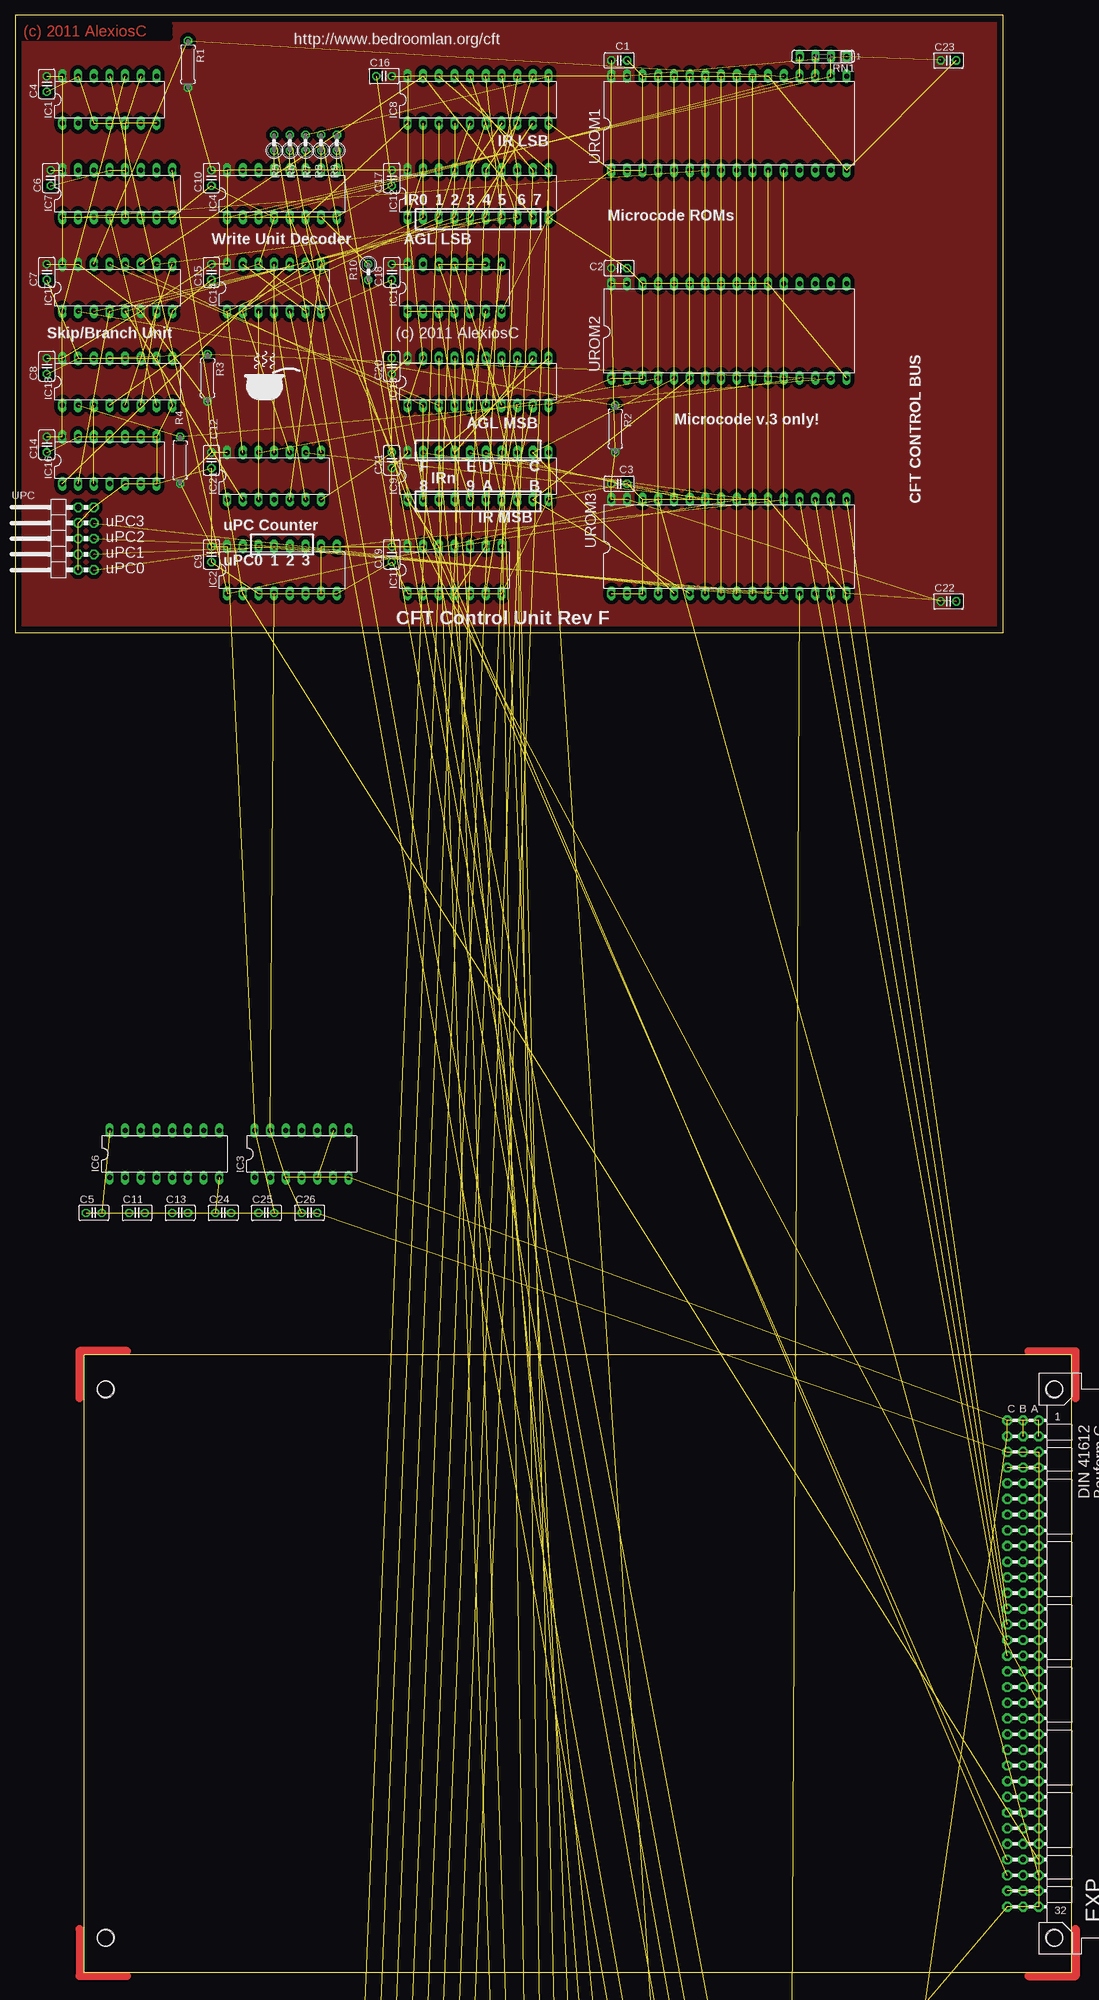
[diagram p4: board, top side]
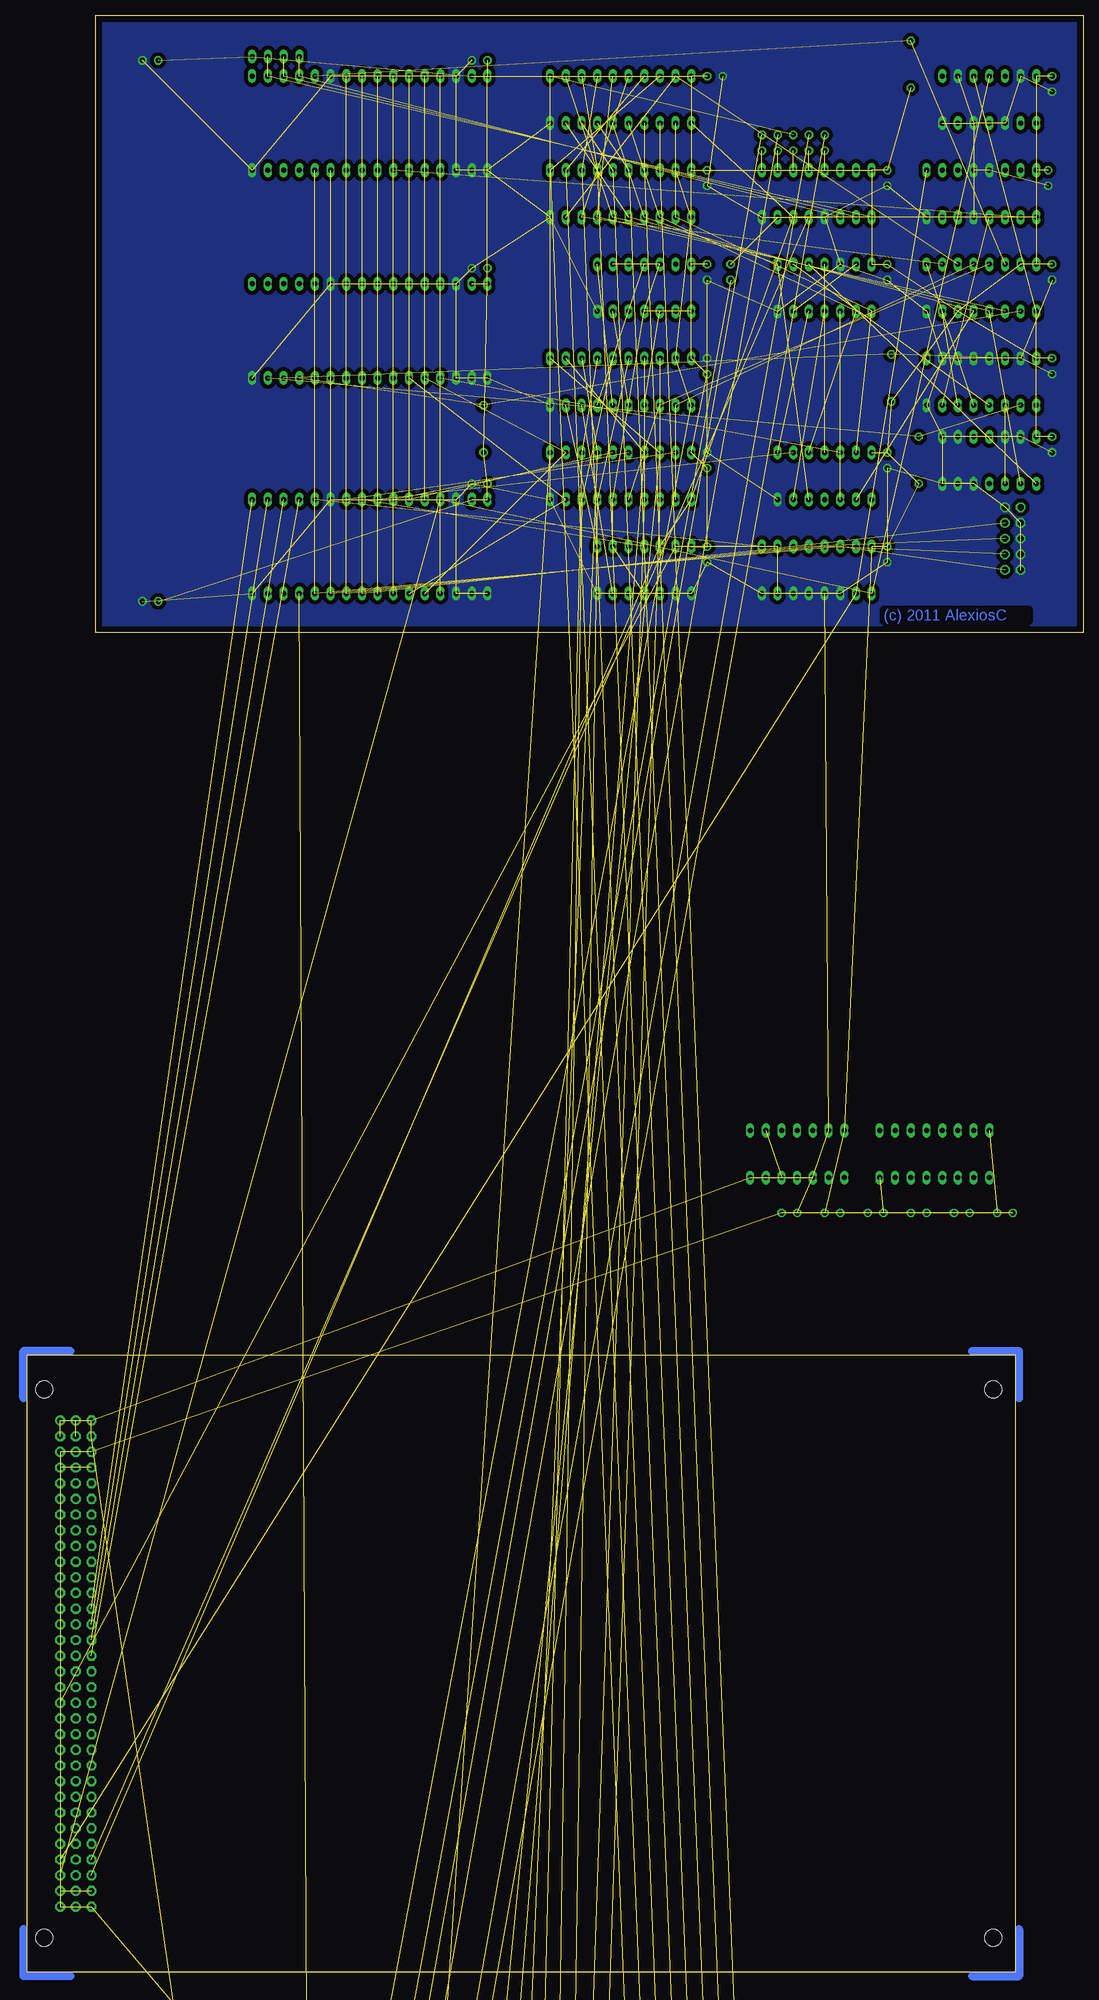
[diagram p5: board, bottom side, seen from below]

Size 171.07 x 317.02 mm. Coordinates in mm from the lower left corner, seen from the top.
Outline: 0,217.02 160,217.02 160,317.02 0,317.02 0,217.02
Copper layers (1*16): off 0.035mm / dielectric 1.5mm / Bottom 0.035mm
Design rules "cft-olimex-10mil": minimum track width 10mil, minimum drill 24mil, track to track 10mil, track to pad 10mil, pad to pad 10mil, via to via 10mil, smd to smd 10mil, copper to edge 40mil, drill to drill 10mil, minimum pad ring 10mil, minimum via ring 10mil, stop-mask expansion 0mil, vias tented up to drill 10mil, thermal gap 10mil

### Footprints (pad centres in the part's own frame; a part is rotated, then mirrored left to right if it is on the bottom)
C025-025X050 = drill 0.813 octagon: 1 -1.27,0; 2 1.27,0
22-23-2081 = drill 1 long: 1 -8.89,0; 2 -6.35,0; 3 -3.81,0; 4 -1.27,0; 5 1.27,0; 6 3.81,0; 7 6.35,0; 8 8.89,0
VG96B = drill 0.914 pad 1.6 round: A1 154.94,39.37 | drill 0.914 pad 1.6 octagon: A2 154.94,36.83; A3 154.94,34.29; A4 154.94,31.75; A5 154.94,29.21; A6 154.94,26.67; A7 154.94,24.13; A8 154.94,21.59; A9 154.94,19.05; A10 154.94,16.51; A11 154.94,13.97; A12 154.94,11.43; A13 154.94,8.89; A14 154.94,6.35; A15 154.94,3.81; A16 154.94,1.27; A17 154.94,-1.27; A18 154.94,-3.81; A19 154.94,-6.35; A20 154.94,-8.89; A21 154.94,-11.43; A22 154.94,-13.97; A23 154.94,-16.51; A24 154.94,-19.05; A25 154.94,-21.59; A26 154.94,-24.13; A27 154.94,-26.67; A28 154.94,-29.21; A29 154.94,-31.75; A30 154.94,-34.29; A31 154.94,-36.83; A32 154.94,-39.37; B1 152.4,39.37; B2 152.4,36.83; B3 152.4,34.29; B4 152.4,31.75; B5 152.4,29.21; B6 152.4,26.67; B7 152.4,24.13; B8 152.4,21.59; B9 152.4,19.05; B10 152.4,16.51; B11 152.4,13.97; B12 152.4,11.43; B13 152.4,8.89; B14 152.4,6.35; B15 152.4,3.81; B16 152.4,1.27; B17 152.4,-1.27; B18 152.4,-3.81; B19 152.4,-6.35; B20 152.4,-8.89; B21 152.4,-11.43; B22 152.4,-13.97; B23 152.4,-16.51; B24 152.4,-19.05; B25 152.4,-21.59; B26 152.4,-24.13; B27 152.4,-26.67; B28 152.4,-29.21; B29 152.4,-31.75; B30 152.4,-34.29; B31 152.4,-36.83; B32 152.4,-39.37; C1 149.86,39.37; C2 149.86,36.83; C3 149.86,34.29; C4 149.86,31.75; C5 149.86,29.21; C6 149.86,26.67; C7 149.86,24.13; C8 149.86,21.59; C9 149.86,19.05; C10 149.86,16.51; C11 149.86,13.97; C12 149.86,11.43; C13 149.86,8.89; C14 149.86,6.35; C15 149.86,3.81; C16 149.86,1.27; C17 149.86,-1.27; C18 149.86,-3.81; C19 149.86,-6.35; C20 149.86,-8.89; C21 149.86,-11.43; C22 149.86,-13.97; C23 149.86,-16.51; C24 149.86,-19.05; C25 149.86,-21.59; C26 149.86,-24.13; C27 149.86,-26.67; C28 149.86,-29.21; C29 149.86,-31.75; C30 149.86,-34.29; C31 149.86,-36.83; C32 149.86,-39.37 | hole 2.794: 157.48,44.45; 157.48,-44.45; 3.81,44.45; 3.81,-44.45
DIL14 = drill 0.813 long: 1 -7.62,-3.81; 2 -5.08,-3.81; 3 -2.54,-3.81; 4 0,-3.81; 5 2.54,-3.81; 6 5.08,-3.81; 7 7.62,-3.81; 8 7.62,3.81; 9 5.08,3.81; 10 2.54,3.81; 11 0,3.81; 12 -2.54,3.81; 13 -5.08,3.81; 14 -7.62,3.81
DIL16 = drill 0.813 long: 1 -8.89,-3.81; 2 -6.35,-3.81; 3 -3.81,-3.81; 4 -1.27,-3.81; 5 1.27,-3.81; 6 3.81,-3.81; 7 6.35,-3.81; 8 8.89,-3.81; 9 8.89,3.81; 10 6.35,3.81; 11 3.81,3.81; 12 1.27,3.81; 13 -1.27,3.81; 14 -3.81,3.81; 15 -6.35,3.81; 16 -8.89,3.81
DIL20 = drill 0.813 long: 1 -11.43,-3.81; 2 -8.89,-3.81; 3 -6.35,-3.81; 4 -3.81,-3.81; 5 -1.27,-3.81; 6 1.27,-3.81; 7 3.81,-3.81; 8 6.35,-3.81; 9 8.89,-3.81; 10 11.43,-3.81; 11 11.43,3.81; 12 8.89,3.81; 13 6.35,3.81; 14 3.81,3.81; 15 1.27,3.81; 16 -1.27,3.81; 17 -3.81,3.81; 18 -6.35,3.81; 19 -8.89,3.81; 20 -11.43,3.81
FE08 = drill 0.813 long: 1 -8.89,0; 2 -6.35,0; 3 -3.81,0; 4 -1.27,0; 5 1.27,0; 6 3.81,0; 7 6.35,0; 8 8.89,0
FE06 = drill 0.813 long: 1 -6.35,0; 2 -3.81,0; 3 -1.27,0; 4 1.27,0; 5 3.81,0; 6 6.35,0
0207/7 = drill 0.813 octagon: 1 -3.81,0; 2 3.81,0
0207/2V = drill 0.813 octagon: 1 -1.27,0; 2 1.27,0
SIL4 = drill 0.813 long: 1 -3.81,0; 2 -1.27,0; 3 1.27,0; 4 3.81,0
SIL6 = drill 0.813 long: 1 -6.35,0; 2 -3.81,0; 3 -1.27,0; 4 1.27,0; 5 3.81,0; 6 6.35,0
SIL8 = drill 0.813 long: 1 -8.89,0; 2 -6.35,0; 3 -3.81,0; 4 -1.27,0; 5 1.27,0; 6 3.81,0; 7 6.35,0; 8 8.89,0
2X05/90 = drill 1.016 octagon: 1 -5.08,-6.35; 2 -5.08,-3.81; 3 -2.54,-6.35; 4 -2.54,-3.81; 5 0,-6.35; 6 0,-3.81; 7 2.54,-6.35; 8 2.54,-3.81; 9 5.08,-6.35; 10 5.08,-3.81
DIL32 = drill 0.813 long: 1 -19.05,-7.62; 2 -16.51,-7.62; 3 -13.97,-7.62; 4 -11.43,-7.62; 5 -8.89,-7.62; 6 -6.35,-7.62; 7 -3.81,-7.62; 8 -1.27,-7.62; 9 1.27,-7.62; 10 3.81,-7.62; 11 6.35,-7.62; 12 8.89,-7.62; 13 11.43,-7.62; 14 13.97,-7.62; 15 16.51,-7.62; 16 19.05,-7.62 | drill 0.8 long: 17 19.05,7.62; 18 16.51,7.62; 19 13.97,7.62; 20 11.43,7.62; 21 8.89,7.62; 22 6.35,7.62; 23 3.81,7.62; 24 1.27,7.62; 25 -1.27,7.62; 26 -3.81,7.62; 27 -6.35,7.62; 28 -8.89,7.62; 29 -11.43,7.62; 30 -13.97,7.62; 31 -16.51,7.62; 32 -19.05,7.62

### Placement (x,y rotation side)
C1  97.79,309.73 180 top
C2  97.79,276.07 180 top
C3  97.79,241.15 180 top
C4  5.08,305.92 90 top
C5  12.7,123.04 0 top
C6  5.71,290.68 90 top
C7  5.08,275.44 90 top
C8  5.08,260.2 90 top
C9  31.75,229.72 90 top
C10  31.75,290.68 90 top
C11  19.68,123.04 0 top
C12  31.75,244.96 90 top
C13  26.67,123.04 0 top
C14  5.08,247.5 90 top
C15  31.75,275.44 90 top
C16  59.69,307.19 0 top
C17  60.96,290.68 90 top
C18  60.96,275.44 90 top
C19  60.96,229.72 90 top
C20  60.96,260.2 90 top
C21  60.96,244.96 90 top
C22  151.13,222.1 0 top
C23  151.13,309.73 0 top
C24  33.66,123.04 0 top
C25  40.64,123.04 0 top
C26  47.62,123.04 0 top
CON5  10.16,-24.92 0 top  (outside the outline)
CON6  32.38,-24.92 0 top  (outside the outline)
EXP  10.79,50.01 0 top
H1  150.5,-22.38 0 top  (outside the outline)
H2  157.48,-22.38 0 top  (outside the outline)
IC1  15.24,303.38 0 top
IC2  43.18,227.18 0 top
IC3  46.35,132.56 0 top
IC4  43.18,288.14 0 top
IC6  24.13,132.56 0 top
IC7  16.51,288.14 0 top
IC8  74.93,303.38 0 top
IC9  74.93,242.42 0 top
IC10  71.12,272.9 0 top
IC11  71.12,227.18 0 top
IC12  74.93,288.14 0 top
IC13  74.93,257.66 0 top
IC14  41.91,272.9 0 top
IC16  15.24,244.96 0 top
IC17  16.51,272.9 0 top
IC18  16.51,257.66 0 top
IC21  41.91,242.42 0 top
P1  64.77,-23.01 0 top  (outside the outline)
P2  86.36,-23.01 0 top  (outside the outline)
P3  105.41,-23.01 0 top  (outside the outline)
P4  121.92,-23.01 0 top  (outside the outline)
P5  138.43,-23.01 0 top  (outside the outline)
R1  27.94,309.09 270 top
R2  97.16,250.04 270 top
R3  31.11,258.29 270 top
R4  26.67,244.96 270 top
R5  41.91,296.39 90 top
R6  44.45,296.39 90 top
R7  46.99,296.39 90 top
R8  49.53,296.39 90 top
R9  52.07,296.39 90 top
R10  57.15,275.44 270 top
RN1  130.81,310.36 180 top
RN5  31.75,-34.44 0 top  (outside the outline)
RN6  10.79,-34.44 0 top  (outside the outline)
U$1  45.09,-28.09 0 top  (outside the outline)
U$3  37.47,254.48 0 top
UPC  6.35,232.26 90 top
UROM1  115.57,299.57 0 top
UROM2  115.57,265.91 0 top
UROM3  115.57,230.99 0 top

### Tracks (layer width: path | path; a pad name or v marks a point on that pad's centre or on a via)
!END  (1 unrouted)
!FPINCADDR  (1 unrouted)
!FPRIO  (1 unrouted)
!FPRMEM  (1 unrouted)
!FPRUN  (1 unrouted)
!FPSTEP  (1 unrouted)
!FPSTOP  (1 unrouted)
!FPWAC  (1 unrouted)
!FPWADDR  (1 unrouted)
!FPWIO  (1 unrouted)
!FPWIR  (1 unrouted)
!FPWMEM  (1 unrouted)
!HALT  (3 unrouted)
!INCPC  (1 unrouted)
!IO  (1 unrouted)
!IRQS  (2 unrouted)
!MEM  (1 unrouted)
!R  (1 unrouted)
!RAGL  (4 unrouted)
!RESET  (5 unrouted)
!RSTHOLD  (5 unrouted)
!SKIP  (3 unrouted)
!W  (1 unrouted)
!WAC  (1 unrouted)
!WALU  (1 unrouted)
!WAR  (1 unrouted)
!WDR  (1 unrouted)
!WIR  (3 unrouted)
!WPC  (1 unrouted)
+3.3V  (2 unrouted)
+12V  (2 unrouted)
AINDEX  (2 unrouted)
CLK1  (2 unrouted)
CLK5  (1 unrouted)
FETCH  (1 unrouted)
FL  (3 unrouted)
FV  (3 unrouted)
GND  (103 unrouted)
  pour Bottom (isolate 0.635, no thermals): 0,217.02 160.02,217.02 160.02,316.08 0,316.08
IBUS0  (2 unrouted)
IBUS1  (2 unrouted)
IBUS2  (2 unrouted)
IBUS3  (2 unrouted)
IBUS4  (2 unrouted)
IBUS5  (2 unrouted)
IBUS6  (2 unrouted)
IBUS7  (2 unrouted)
IBUS8  (2 unrouted)
IBUS9  (2 unrouted)
IBUS10  (2 unrouted)
IBUS11  (2 unrouted)
IBUS12  (2 unrouted)
IBUS13  (2 unrouted)
IBUS14  (2 unrouted)
IBUS15  (2 unrouted)
IR0  (3 unrouted)
IR1  (3 unrouted)
IR2  (3 unrouted)
IR3  (3 unrouted)
IR4  (3 unrouted)
IR5  (2 unrouted)
IR6  (2 unrouted)
IR7  (2 unrouted)
IR8  (2 unrouted)
IR9  (2 unrouted)
IR10  (6 unrouted)
IR11  (3 unrouted)
IR12  (3 unrouted)
IR13  (3 unrouted)
IR14  (3 unrouted)
IR15  (3 unrouted)
N$1  (3 unrouted)
N$2  (1 unrouted)
N$7  (1 unrouted)
N$8  (1 unrouted)
N$9  (1 unrouted)
N$10  (1 unrouted)
N$11  (1 unrouted)
N$12  (1 unrouted)
N$13  (1 unrouted)
N$14  (1 unrouted)
OP1_BRANCH  (1 unrouted)
OP2_ROLL  (1 unrouted)
OPIF0  (2 unrouted)
OPIF1  (2 unrouted)
OPIF2  (2 unrouted)
OPIF3  (2 unrouted)
PAGE0  (1 unrouted)
PAGE1  (1 unrouted)
PAGE2  (1 unrouted)
PAGE3  (1 unrouted)
PAGE4  (1 unrouted)
PAGE5  (1 unrouted)
RSTHOLD  (2 unrouted)
SKIP0  (1 unrouted)
SL  (1 unrouted)
SN  (1 unrouted)
SZ  (1 unrouted)
UPC0  (4 unrouted)
UPC1  (4 unrouted)
UPC2  (4 unrouted)
UPC3  (4 unrouted)
VCC  (64 unrouted)
  pour off (isolate 0.635, no thermals): 0,217.02 160.02,217.02 160.02,316.08 0,316.08
WUNIT0  (2 unrouted)
WUNIT1  (2 unrouted)
WUNIT2  (2 unrouted)
YA  (1 unrouted)
YB  (1 unrouted)

### Text on the board
off: (c) 2011 AlexiosC
Bottom: (c) 2011 AlexiosC
tNames: http://www.bedroomlan.org/cft | IR LSB | IR0 | 1 | 2 | 3 | 4 | 5 | 6 | 7 | Microcode ROMs | Write Unit Decoder | AGL LSB | Skip/Branch Unit | (c) 2011 AlexiosC | Microcode v.3 only! | AGL MSB | F | E | D | C | IRn | 8 | 9 | A | B | CFT CONTROL BUS | IR MSB | uPC3 | uPC Counter | uPC2 | uPC1 | uPC0 | 1 | 2 | 3 | uPC0 | CFT Control Unit Rev F